# EAGLE design fmpak (EAGLE 5.01)
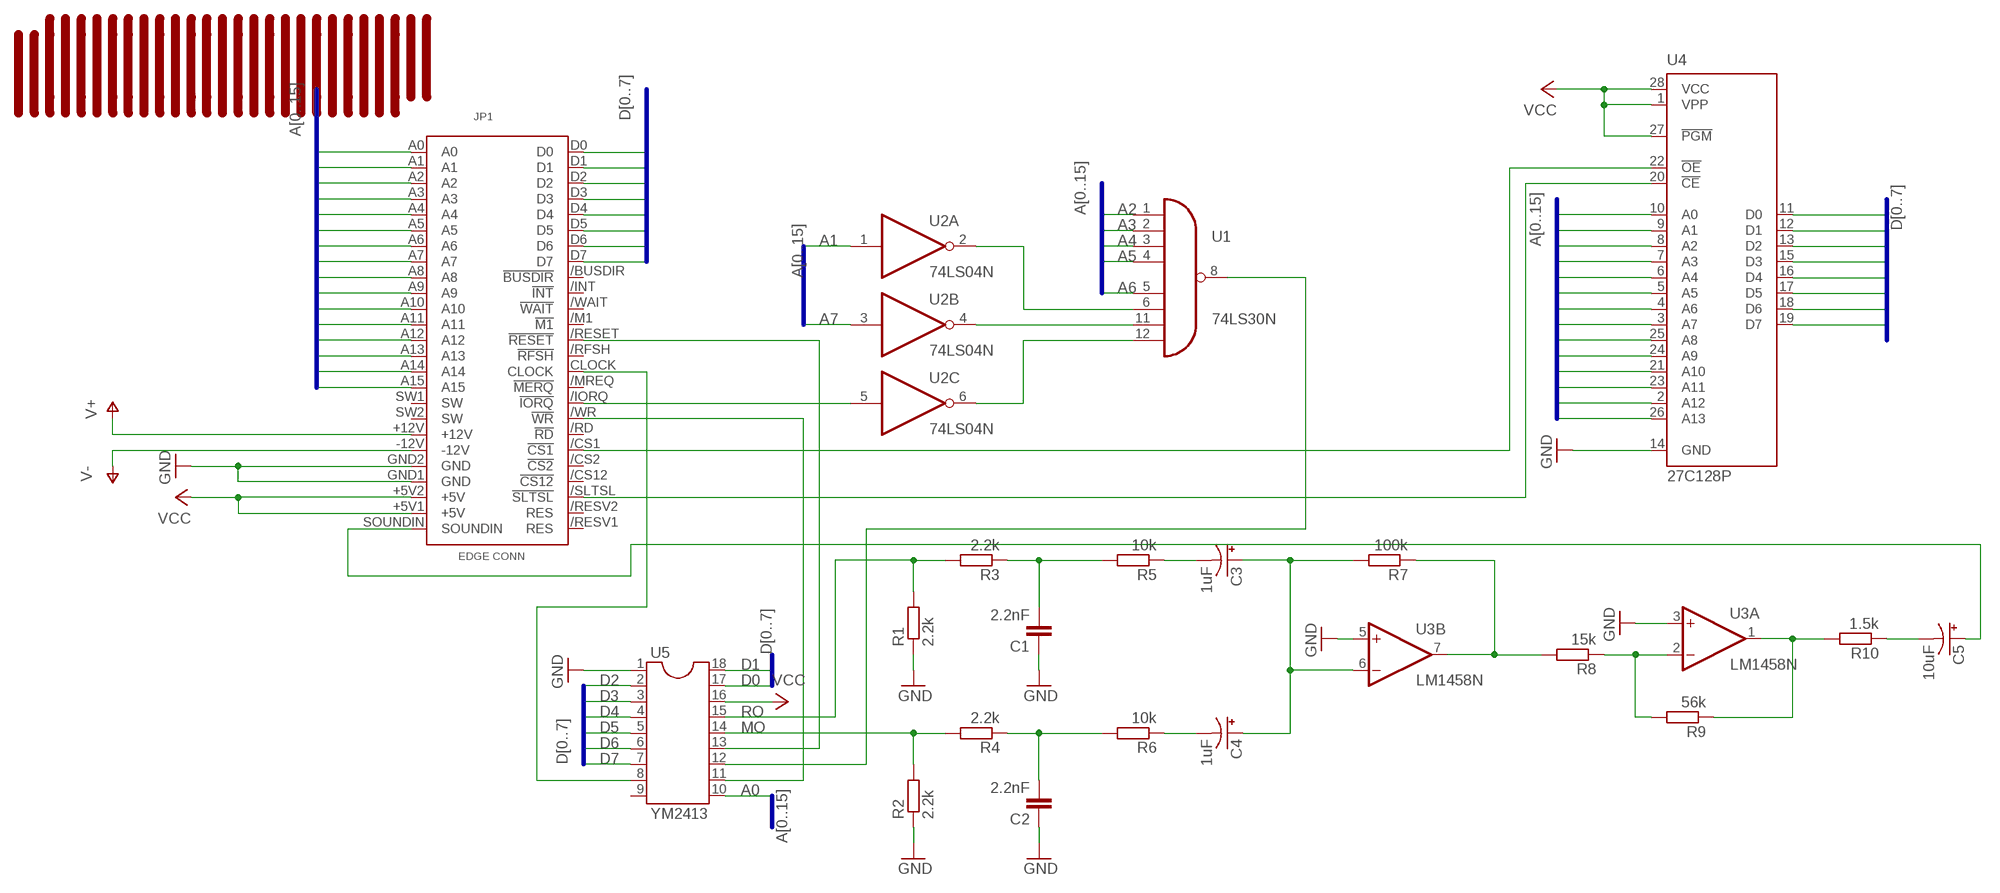
[diagram p0: schematic, sheet 1]

## Parts
C1  2.2nF  C5/2.5  [C5B2.5]
C2  2.2nF  C5/2.5  [C5B2.5]
C3  1uF  CPOL-USE2,5-6E  [E2,5-6E]
C4  1uF  CPOL-USE2,5-6E  [E2,5-6E]
C5  10uF  CPOL-USE2,5-6E  [E2,5-6E]
JP1  MSXCART  [MSXCART]
R1  2.2k  R-EU_0204/5  [0204/5]
R2  2.2k  R-EU_0204/5  [0204/5]
R3  2.2k  R-EU_0204/5  [0204/5]
R4  2.2k  R-EU_0204/5  [0204/5]
R5  10k  R-EU_0204/5  [0204/5]
R6  10k  R-EU_0204/5  [0204/5]
R7  100k  R-EU_0204/5  [0204/5]
R8  15k  R-EU_0204/5  [0204/5]
R9  56k  R-EU_0204/5  [0204/5]
R10  1.5k  R-EU_0204/5  [0204/5]
U1  74LS30N  [DIL14]
U2  74LS04N  [DIL14]
U3  LM1458N  [DIL08]
U4  27C128P  [DIL28-6]
U5  YM2413  DIL18S  [SOCKET-18]

## Nets
A0: JP1.A0 U4.10(A0) U5.10
A1: JP1.A1 U2.1(A:I) U4.9(A1)
A2: JP1.A2 U1.1(I0) U4.8(A2)
A3: JP1.A3 U1.2(I1) U4.7(A3)
A4: JP1.A4 U1.3(I2) U4.6(A4)
A5: JP1.A5 U1.4(I3) U4.5(A5)
A6: JP1.A6 U1.5(I4) U4.4(A6)
A7: JP1.A7 U2.3(B:I) U4.3(A7)
A8: JP1.A8 U4.25(A8)
A9: JP1.A9 U4.24(A9)
A10: JP1.A10 U4.21(A10)
A11: JP1.A11 U4.23(A11)
A12: JP1.A12 U4.2(A12)
A13: JP1.A13 U4.26(A13)
A14: JP1.A14
A15: JP1.A15
D0: JP1.D0 U4.11(D0) U5.17
D1: JP1.D1 U4.12(D1) U5.18
D2: JP1.D2 U4.13(D2) U5.2
D3: JP1.D3 U4.15(D3) U5.3
D4: JP1.D4 U4.16(D4) U5.4
D5: JP1.D5 U4.17(D5) U5.5
D6: JP1.D6 U4.18(D6) U5.6
D7: JP1.D7 U4.19(D7) U5.7
GND: C1.1 C2.1 JP1.GND1(GND) JP1.GND2(GND) R1.1 R2.1 U3.3(A:+IN) U3.5(B:+IN) U4.14(GND) U5.1
MO: R2.2 R4.2 U5.14
N$2: C1.2 R3.1 R5.2
N$3: C3.- R5.1
N$5: C2.2 R4.1 R6.2
N$6: C4.- R6.1
N$7: C3.+ C4.+ R7.2 U3.6(B:-IN)
N$8: R7.1 R8.2 U3.7(B:OUT)
N$9: R8.1 R9.2 U3.2(A:-IN)
N$10: R9.1 R10.2 U3.1(A:OUT)
N$11: C5.- R10.1
N$12: U1.6(I5) U2.2(A:O)
N$13: U1.11(I6) U2.4(B:O)
N$14: U1.12(I7) U2.6(C:O)
N$15: U1.8(O) U5.12
N$16: JP1./RESET(!RESET) U5.13
N$17: JP1./WR(!WR) U5.11
N$18: JP1.CLOCK U5.8
N$19: JP1./CS1(!CS1) U4.22(!OE)
N$20: JP1./SLTSL(!SLTSL) U4.20(!CE)
N$21: C5.+ JP1.SOUNDIN
N$23: JP1./IORQ(!IORQ) U2.5(C:I)
RO: R1.2 R3.2 U5.15
V+: JP1.+12V
V-: JP1.-12V
VCC: JP1.+5V1(+5V) JP1.+5V2(+5V) U4.1(VPP) U4.27(!PGM) U4.28(VCC) U5.16
Unconnected: JP1./BUSDIR(!BUSDIR) JP1./CS2(!CS2) JP1./CS12(!CS12) JP1./INT(!INT) JP1./M1(!M1) JP1./MREQ(!MERQ) JP1./RD(!RD) JP1./RESV1(RES) JP1./RESV2(RES) JP1./RFSH(!RFSH) JP1./WAIT(!WAIT) JP1.SW1(SW) JP1.SW2(SW) U2.8(D:O) U2.9(D:I) U2.10(E:O) U2.11(E:I) U2.12(F:O) U2.13(F:I) U5.9

## Buses
A[0..15]
D[0..7]

## Power pins joined to a net without a drawn wire
GND: U1.7(GND) U2.7(P:GND)
V+: U3.8(P:V+)
V-: U3.4(P:V-)
VCC: U1.14(VCC) U2.14(P:VCC)

## Library data of the parts
C1 C2 = capacitor-wima:C: CAPACITOR naming: grid - package width
C3-C5 = resistor:CPOL-US: POLARIZED CAPACITOR, American symbol
JP1 = MSX-CON:MSXCART
R1-R10 = resistor:R-EU_: RESISTOR, European symbol
U1 = 74xx-eu:74*30: 8-input NAND gate
U2 = 74xx-eu:74*04: Hex INVERTER
U3 = linear:*1458: OP AMP
U4 = microchip:27*128: CMOS EPROM 128 K (16 K x 8)
U5 = ic-package:DIL18: Dual In Line / Socket

## Board
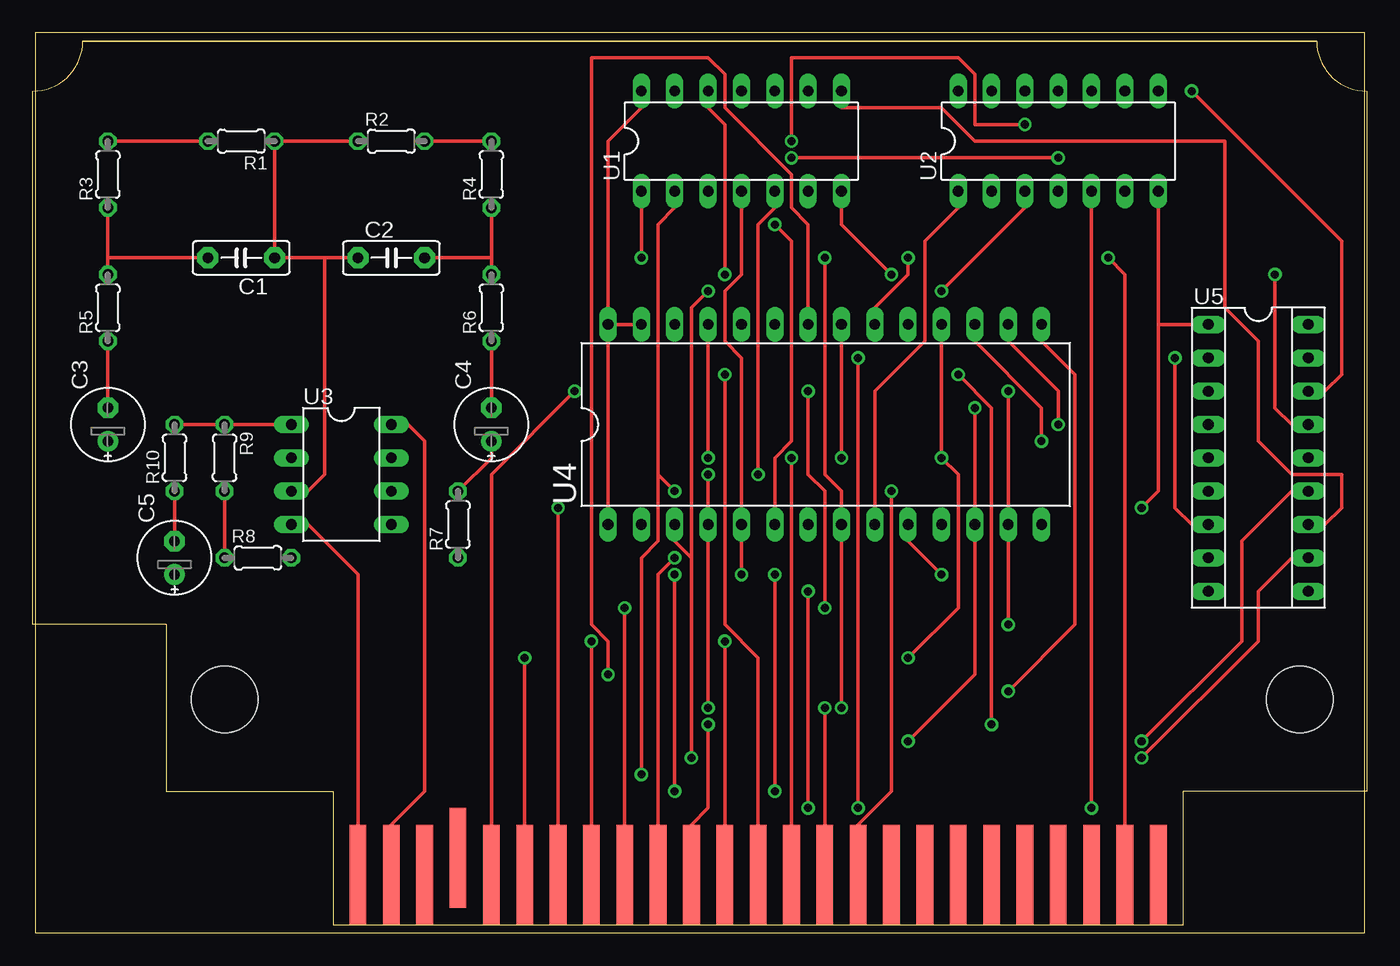
[diagram p1: board, top side]
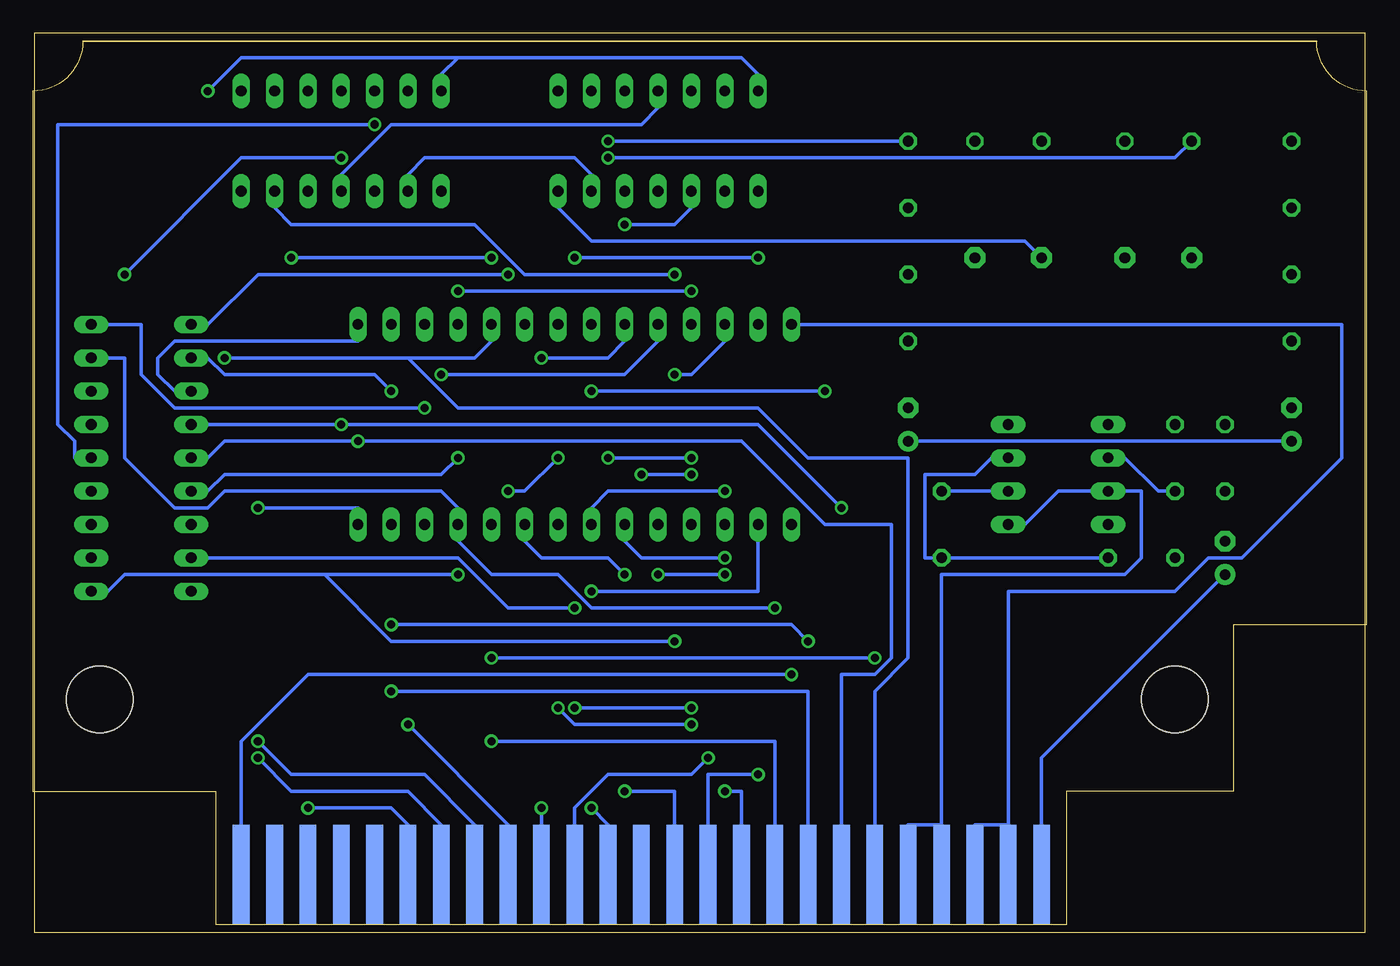
[diagram p2: board, bottom side, seen from below]

Size 101.27 x 68.57 mm. Coordinates in mm from the lower left corner, seen from the top.
Outline: 0,0 101.27,0 101.27,68.57 0,68.57 0,0
Copper layers (1*16): Top 0.035mm / dielectric 1.5mm / Bottom 0.035mm
Design rules "default": minimum track width 10mil, minimum drill 24mil, track to track 8mil, track to pad 8mil, pad to pad 8mil, via to via 8mil, smd to smd 8mil, copper to edge 40mil, drill to drill 8mil, minimum pad ring 10mil, minimum via ring 8mil, stop-mask expansion 4mil, vias tented up to drill 0mil, thermal gap 10mil

### Footprints (pad centres in the part's own frame; a part is rotated, then mirrored left to right if it is on the bottom)
C5B2.5 = drill 0.813 pad 1.6 octagon: 1 -2.54,0; 2 2.54,0
E2,5-6E = drill 0.813 pad 1.575 round: + -1.27,0 | drill 0.813 pad 1.575 octagon: - 1.27,0
MSXCART = smd 1.27 x 7.62 bottom: +5V1 -24.13,-36.83; +5V2 -21.59,-36.83; /CS1 34.29,-36.83; /CS12 31.75,-36.83; /IORQ 21.59,-36.83; /M1 24.13,-36.83; /RESET 16.51,-36.83; /RESV2 29.21,-36.83; /WAIT 26.67,-36.83; /WR 19.05,-36.83; A1 1.27,-36.83; A3 -1.27,-36.83; A5 -3.81,-36.83; A7 8.89,-36.83; A9 13.97,-36.83; A11 11.43,-36.83; A12 6.35,-36.83; A14 3.81,-36.83; D1 -6.35,-36.83; D3 -8.89,-36.83; D5 -11.43,-36.83; D7 -13.97,-36.83; GND1 -19.05,-36.83; GND2 -16.51,-36.83; SOUNDIN -26.67,-36.83 | smd 1.27 x 7.62: +12V -24.13,-36.83; -12V -26.67,-36.83; /BUSDIR 24.13,-36.83; /CS2 34.29,-36.83; /INT 26.67,-36.83; /MREQ 21.59,-36.83; /RD 19.05,-36.83; /RESV1 16.51,-36.83; /RFSH 29.21,-36.83; /SLTSL 31.75,-36.83; A0 1.27,-36.83; A2 -1.27,-36.83; A4 -3.81,-36.83; A6 8.89,-36.83; A8 6.35,-36.83; A10 11.43,-36.83; A13 3.81,-36.83; A15 13.97,-36.83; CLOCK -16.51,-36.83; D0 -6.35,-36.83; D2 -8.89,-36.83; D4 -11.43,-36.83; D6 -13.97,-36.83; SW1 -19.05,-35.56; SW2 -21.59,-36.83 | hole 5.08: -36.83,-23.495; 45.085,-23.495
0204/5 = drill 0.813 octagon: 1 -2.54,0; 2 2.54,0
DIL14 = drill 0.813 long: 1 -7.62,-3.81; 2 -5.08,-3.81; 3 -2.54,-3.81; 4 0,-3.81; 5 2.54,-3.81; 6 5.08,-3.81; 7 7.62,-3.81; 8 7.62,3.81; 9 5.08,3.81; 10 2.54,3.81; 11 0,3.81; 12 -2.54,3.81; 13 -5.08,3.81; 14 -7.62,3.81
DIL08 = drill 0.813 long: 1 -3.81,-3.81; 2 -1.27,-3.81; 3 1.27,-3.81; 4 3.81,-3.81; 5 3.81,3.81; 6 1.27,3.81; 7 -1.27,3.81; 8 -3.81,3.81
DIL28-6 = drill 0.813 long: 1 -16.51,-7.62; 2 -13.97,-7.62; 3 -11.43,-7.62; 4 -8.89,-7.62; 5 -6.35,-7.62; 6 -3.81,-7.62; 7 -1.27,-7.62; 8 1.27,-7.62; 9 3.81,-7.62; 10 6.35,-7.62; 11 8.89,-7.62; 12 11.43,-7.62; 13 13.97,-7.62; 14 16.51,-7.62; 15 16.51,7.62; 16 13.97,7.62; 17 11.43,7.62; 18 8.89,7.62; 19 6.35,7.62; 20 3.81,7.62; 21 1.27,7.62; 22 -1.27,7.62; 23 -3.81,7.62; 24 -6.35,7.62; 25 -8.89,7.62; 26 -11.43,7.62; 27 -13.97,7.62; 28 -16.51,7.62
SOCKET-18 = drill 0.813 long: 1 -10.16,-3.81; 2 -7.62,-3.81; 3 -5.08,-3.81; 4 -2.54,-3.81; 5 0,-3.81; 6 2.54,-3.81; 7 5.08,-3.81; 8 7.62,-3.81; 9 10.16,-3.81; 10 10.16,3.81; 11 7.62,3.81; 12 5.08,3.81; 13 2.54,3.81; 14 0,3.81; 15 -2.54,3.81; 16 -5.08,3.81; 17 -7.62,3.81; 18 -10.16,3.81

### Placement (x,y rotation side)
C1  15.71,51.43 180 top
C2  27.14,51.43 0 top
C3  5.55,38.73 90 top
C4  34.76,38.73 90 top
C5  10.63,28.57 90 top
JP1  51.27,41.27 0 top
R1  15.71,60.32 180 top
R2  27.14,60.32 0 top
R3  5.55,57.78 90 top
R4  34.76,57.78 90 top
R5  5.55,47.62 90 top
R6  34.76,47.62 90 top
R7  32.22,31.11 90 top
R8  16.98,28.57 0 top
R9  14.44,36.19 270 top
R10  10.63,36.19 90 top
U1  53.81,60.32 0 top
U2  77.94,60.32 0 top
U3  23.33,34.92 270 top
U4  60.16,38.73 0 top
U5  93.18,36.19 270 top

### Tracks (layer width: path | path; a pad name or v marks a point on that pad's centre or on a via)
A0  (via drill 0.61)
  Top 0.254: v69.05,27.3 66.51,29.84 U4.10 | JP1.A0 v52.54,22.22
  Bottom 0.254: 79.21,27.3 94.45,27.3 95.72,26.03 U5.10 | 79.21,27.3 v69.05,27.3 | v52.54,22.22 74.13,22.22 79.21,27.3
A1  (via drill 0.61)
  Top 0.254: U4.9 63.97,41.27 67.78,45.08 67.78,52.7 70.32,55.24 U2.1 | v56.35,10.79 v56.35,27.3
  Bottom 0.254: v56.35,10.79 52.54,10.79 JP1.A1 | v56.35,27.3 57.62,28.57 62.7,28.57 63.97,29.84 U4.9
A2  (via drill 0.61)
  Top 0.254: v51.27,15.87 51.27,9.52 50,8.25 JP1.A2 | v61.43,17.14 U4.8 61.43,33.65 60.16,34.92 v60.16,51.43 | v46.19,51.43 U1.1
  Bottom 0.254: v61.43,17.14 60.16,15.87 v51.27,15.87 | v60.16,51.43 v46.19,51.43
A3  (via drill 0.61)
  Top 0.254: 47.46,34.92 v48.73,33.65 | 47.46,34.92 47.46,53.97 48.73,55.24 U1.2 | v46.19,12.06 46.19,28.57 47.46,29.84 47.46,34.92
  Bottom 0.254: v48.73,33.65 57.62,33.65 58.89,32.38 U4.7 | v46.19,12.06 50,12.06 JP1.A3
A4  (via drill 0.61)
  Top 0.254: v48.73,28.57 47.46,27.3 JP1.A4 | v56.35,53.97 57.62,52.7 57.62,37.46 56.35,36.19 U4.6
  Bottom 0.254: v48.73,28.57 55.08,28.57 56.35,29.84 U4.6 | v56.35,53.97 52.54,53.97 51.27,55.24 U1.3
A5  (via drill 0.61)
  Top 0.254: U1.4 53.81,50.16 52.54,48.89 52.54,45.08 53.81,43.81 U4.5 v53.81,27.3 | v48.73,10.79 v48.73,27.3
  Bottom 0.254: v48.73,10.79 47.46,10.79 JP1.A5 | v48.73,27.3 v53.81,27.3
A6  (via drill 0.61)
  Top 0.254: v51.27,17.14 U4.4 v51.27,34.92 | JP1.A6 v60.16,17.14 | v55.08,34.92 55.08,53.97 56.35,55.24 U1.5
  Bottom 0.254: v60.16,17.14 v51.27,17.14 | v51.27,34.92 v55.08,34.92
A7  (via drill 0.61)
  Top 0.254: 50,28.57 48.73,29.84 U4.3 | v50,13.33 50,28.57 | v69.05,48.89 75.4,55.24 U2.3 | v51.27,48.89 50,47.62 50,28.57
  Bottom 0.254: v50,13.33 51.27,12.06 57.62,12.06 60.16,9.52 JP1.A7 | v51.27,48.89 v69.05,48.89
A8  (via drill 0.61)
  Top 0.254: v51.27,36.19 U4.25 | JP1.A8 v57.62,36.19
  Bottom 0.254: v57.62,36.19 v51.27,36.19
A9  (via drill 0.61)
  Top 0.254: v70.32,42.54 72.86,40 v72.86,15.87
  Bottom 0.254: v70.32,42.54 56.35,42.54 53.81,45.08 U4.24 | v72.86,15.87 65.24,8.25 JP1.A9
A10  (via drill 0.61)
  Top 0.254: v65.24,33.65 65.24,10.79 62.7,8.25 JP1.A10 | v61.43,36.19 U4.21
  Bottom 0.254: v61.43,36.19 63.97,33.65 v65.24,33.65
A11  (via drill 0.61)
  Top 0.254: v62.7,9.52 v62.7,43.81
  Bottom 0.254: v62.7,43.81 57.62,43.81 56.35,45.08 U4.23 | JP1.A11 v62.7,9.52
A12  (via drill 0.61)
  Top 0.254: v58.89,9.52 v58.89,26.03
  Bottom 0.254: v58.89,26.03 46.19,26.03 U4.2 | v58.89,9.52 57.62,8.25 JP1.A12
A13  (via drill 0.61)
  Top 0.254: v52.54,42.54 52.54,23.49 55.08,20.95 JP1.A13
  Bottom 0.254: v52.54,42.54 51.27,42.54 48.73,45.08 U4.26
D0  (via drill 0.61)
  Top 0.254: JP1.D0 v44.92,24.76
  Bottom 0.254: U5.17 94.45,43.81 94.45,36.19 90.64,32.38 88.1,32.38 86.83,33.65 70.32,33.65 69.05,32.38 U4.11 69.05,29.84 66.51,27.3 61.43,27.3 58.89,24.76 v44.92,24.76
D1  (via drill 0.61)
  Top 0.254: v71.59,40 U4.12 71.59,19.68 v66.51,14.6
  Bottom 0.254: v71.59,40 90.64,40 93.18,42.54 93.18,46.35 U5.18 | v66.51,14.6 44.92,14.6 JP1.D1
D2  (via drill 0.61)
  Top 0.254: v74.13,41.27 U4.13 v74.13,23.49 | JP1.D2 v42.38,22.22
  Bottom 0.254: v74.13,41.27 75.4,42.54 86.83,42.54 88.1,43.81 U5.2 | v42.38,22.22 43.65,23.49 v74.13,23.49
D3  (via drill 0.61)
  Top 0.254: v74.13,18.41 79.21,23.49 79.21,42.54 76.67,45.08 U4.15
  Bottom 0.254: U4.15 76.67,45.08 90.64,45.08 91.91,43.81 91.91,42.54 90.64,41.27 U5.3 | v74.13,18.41 42.38,18.41 JP1.D3
D4  (via drill 0.61)
  Top 0.254: v77.94,38.73 77.94,41.27 74.13,45.08 U4.16 | JP1.D4 v39.84,32.38
  Bottom 0.254: U5.4 v77.94,38.73 46.19,38.73 v39.84,32.38
D5  (via drill 0.61)
  Top 0.254: v76.67,37.46 76.67,40 71.59,45.08 U4.17
  Bottom 0.254: U5.5 88.1,36.19 86.83,37.46 v76.67,37.46 47.46,37.46 41.11,31.11 36.03,31.11 36.03,20.95 37.3,19.68 39.84,19.68 JP1.D5
D6  (via drill 0.61)
  Top 0.254: U4.18 v69.05,36.19 70.32,34.92 70.32,24.76 v66.51,20.95 | JP1.D6 v37.3,20.95
  Bottom 0.254: v69.05,36.19 70.32,34.92 86.83,34.92 88.1,33.65 U5.6 | v37.3,20.95 v66.51,20.95
D7  (via drill 0.61)
  Top 0.254: v86.83,43.81 86.83,32.38 88.1,31.11 U5.7
  Bottom 0.254: 72.86,43.81 67.78,43.81 66.51,45.08 U4.19 | 72.86,43.81 v86.83,43.81 | 72.86,43.81 69.05,40 46.19,40 42.38,36.19 34.76,36.19 34.76,20.95 37.3,18.41 JP1.D7
GND  (via drill 0.61)
  Top 0.254: v84.29,32.38 85.56,33.65 85.56,46.35 | 85.56,46.35 U2.7 | U5.1 85.56,46.35 | R2.1 R1.1 C1.1 22.06,51.43 | 22.06,51.43 C2.1 | 22.06,51.43 22.06,34.92 20.79,33.65 U3.3 | v65.24,50.16 61.43,53.97 U1.7
  Bottom 0.254: v84.29,32.38 76.67,32.38 U4.14 | 32.22,8.25 34.76,8.25 JP1.GND2 | JP1.GND1 32.22,8.25 | U3.5 25.87,31.11 23.33,33.65 U3.3 16.98,33.65 16.98,28.57 18.25,27.3 32.22,27.3 32.22,8.25 | C2.1 25.87,52.7 58.89,52.7 61.43,55.24 U1.7 | v65.24,50.16 84.29,50.16 88.1,46.35 U5.1
MO  (via drill 0.61)
  Top 0.254: R2.2 R4.2 | v75.4,61.59 71.59,61.59 71.59,65.4 70.32,66.67 57.62,66.67 v57.62,60.32
  Bottom 0.254: v75.4,61.59 99.53,61.59 99.53,38.73 98.26,37.46 98.26,36.19 U5.14 | R4.2 v57.62,60.32
N$2
  Top 0.254: 5.55,51.43 R3.1 | R5.2 5.55,51.43 | 5.55,51.43 C1.2
N$3
  Top 0.254: C3.- R5.1
N$5
  Top 0.254: 34.76,51.43 R4.1 | 34.76,51.43 R6.2 | C2.2 34.76,51.43
N$6
  Top 0.254: C4.- R6.1
N$7
  Top 0.254: R7.2 34.76,36.19 C4.+
  Bottom 0.254: R7.2 U3.6 | C3.+ C4.+
N$8
  Bottom 0.254: R8.2 R7.1 33.49,28.57 33.49,34.92 29.68,34.92 28.41,36.19 U3.7
N$9
  Top 0.254: R8.1 R9.2
  Bottom 0.254: R9.2 15.71,33.65 18.25,36.19 U3.2
N$10
  Top 0.254: R10.2 R9.1 U3.1
N$11
  Top 0.254: C5.- R10.1
N$12
  Bottom 0.254: U1.6 58.89,57.78 60.16,59.05 71.59,59.05 72.86,57.78 U2.2
N$13
  Bottom 0.254: U1.11 53.81,62.86 55.08,61.59 74.13,61.59 77.94,57.78 U2.4
N$14  (via drill 0.61)
  Top 0.254: v52.54,50.16 52.54,61.59 51.27,62.86 U1.12
  Bottom 0.254: v52.54,50.16 63.97,50.16 67.78,53.97 81.75,53.97 83.02,55.24 U2.6
N$15
  Top 0.254: U1.8 61.43,62.86 69.05,62.86 71.59,60.32 90.64,60.32 90.64,47.62 93.18,45.08 93.18,37.46 95.72,34.92 99.53,34.92 99.53,32.38 98.26,31.11 U5.12
N$16  (via drill 0.61)
  Top 0.254: v84.29,14.6 91.91,22.22 91.91,29.84 95.72,33.65 U5.13
  Bottom 0.254: v84.29,14.6 81.75,12.06 71.59,12.06 67.78,8.25 JP1./RESET
N$17  (via drill 0.61)
  Top 0.254: v84.29,13.33 93.18,22.22 93.18,26.03 95.72,28.57 U5.11
  Bottom 0.254: v84.29,13.33 81.75,10.79 72.86,10.79 70.32,8.25 JP1./WR
N$18  (via drill 0.61)
  Top 0.254: v60.16,24.76 60.16,33.65 58.89,34.92 v58.89,41.27 | v41.11,41.27 34.76,34.92 JP1.CLOCK
  Bottom 0.254: v60.16,24.76 65.24,24.76 69.05,28.57 U5.8 | v41.11,41.27 v58.89,41.27
N$19  (via drill 0.61)
  Top 0.254: v43.65,19.68 43.65,22.22 42.38,23.49 42.38,66.67 51.27,66.67 52.54,65.4 52.54,62.86 57.62,57.78 57.62,55.24 58.89,53.97 U4.22
  Bottom 0.254: v43.65,19.68 80.48,19.68 85.56,14.6 JP1./CS1
N$20  (via drill 0.61)
  Top 0.254: v66.51,51.43 66.51,50.16 63.97,47.62 U4.20 | v81.75,51.43 83.02,50.16 JP1./SLTSL
  Bottom 0.254: v81.75,51.43 v66.51,51.43
N$21
  Bottom 0.254: C5.+ 24.6,13.33 JP1.SOUNDIN
N$23  (via drill 0.61)
  Top 0.254: v80.48,9.52 U2.5
  Bottom 0.254: v80.48,9.52 74.13,9.52 72.86,8.25 JP1./IORQ
RO  (via drill 0.61)
  Top 0.254: R3.2 R1.2 | v94.45,50.16 94.45,40 95.72,38.73 U5.15 | v57.62,59.05 v77.94,59.05
  Bottom 0.254: v94.45,50.16 85.56,59.05 v77.94,59.05 | v57.62,59.05 14.44,59.05 R1.2
V+
  Top 0.254: U3.8 28.41,38.73 29.68,37.46 29.68,10.79 27.14,8.25 JP1.+12V
V-
  Top 0.254: U3.4 20.79,31.11 24.6,27.3 JP1.-12V
VCC  (via drill 0.61)
  Top 0.254: U4.28 U4.1 | U4.28 U4.27 | U1.14 46.19,62.86 43.65,60.32 U4.28 | v88.1,64.13 99.53,52.7 99.53,42.54 98.26,41.27 U5.16
  Bottom 0.254: 27.14,8.25 29.68,8.25 JP1.+5V2 | JP1.+5V1 27.14,8.25 | 69.05,66.67 70.32,65.4 U2.14 | 69.05,66.67 47.46,66.67 46.19,65.4 U1.14 | v88.1,64.13 85.56,66.67 69.05,66.67 | 27.14,8.25 27.14,26.03 14.44,26.03 11.9,28.57 9.36,28.57 1.74,36.19 1.74,46.35 U4.28